# EAGLE design Captura_revB (EAGLE 5.11)
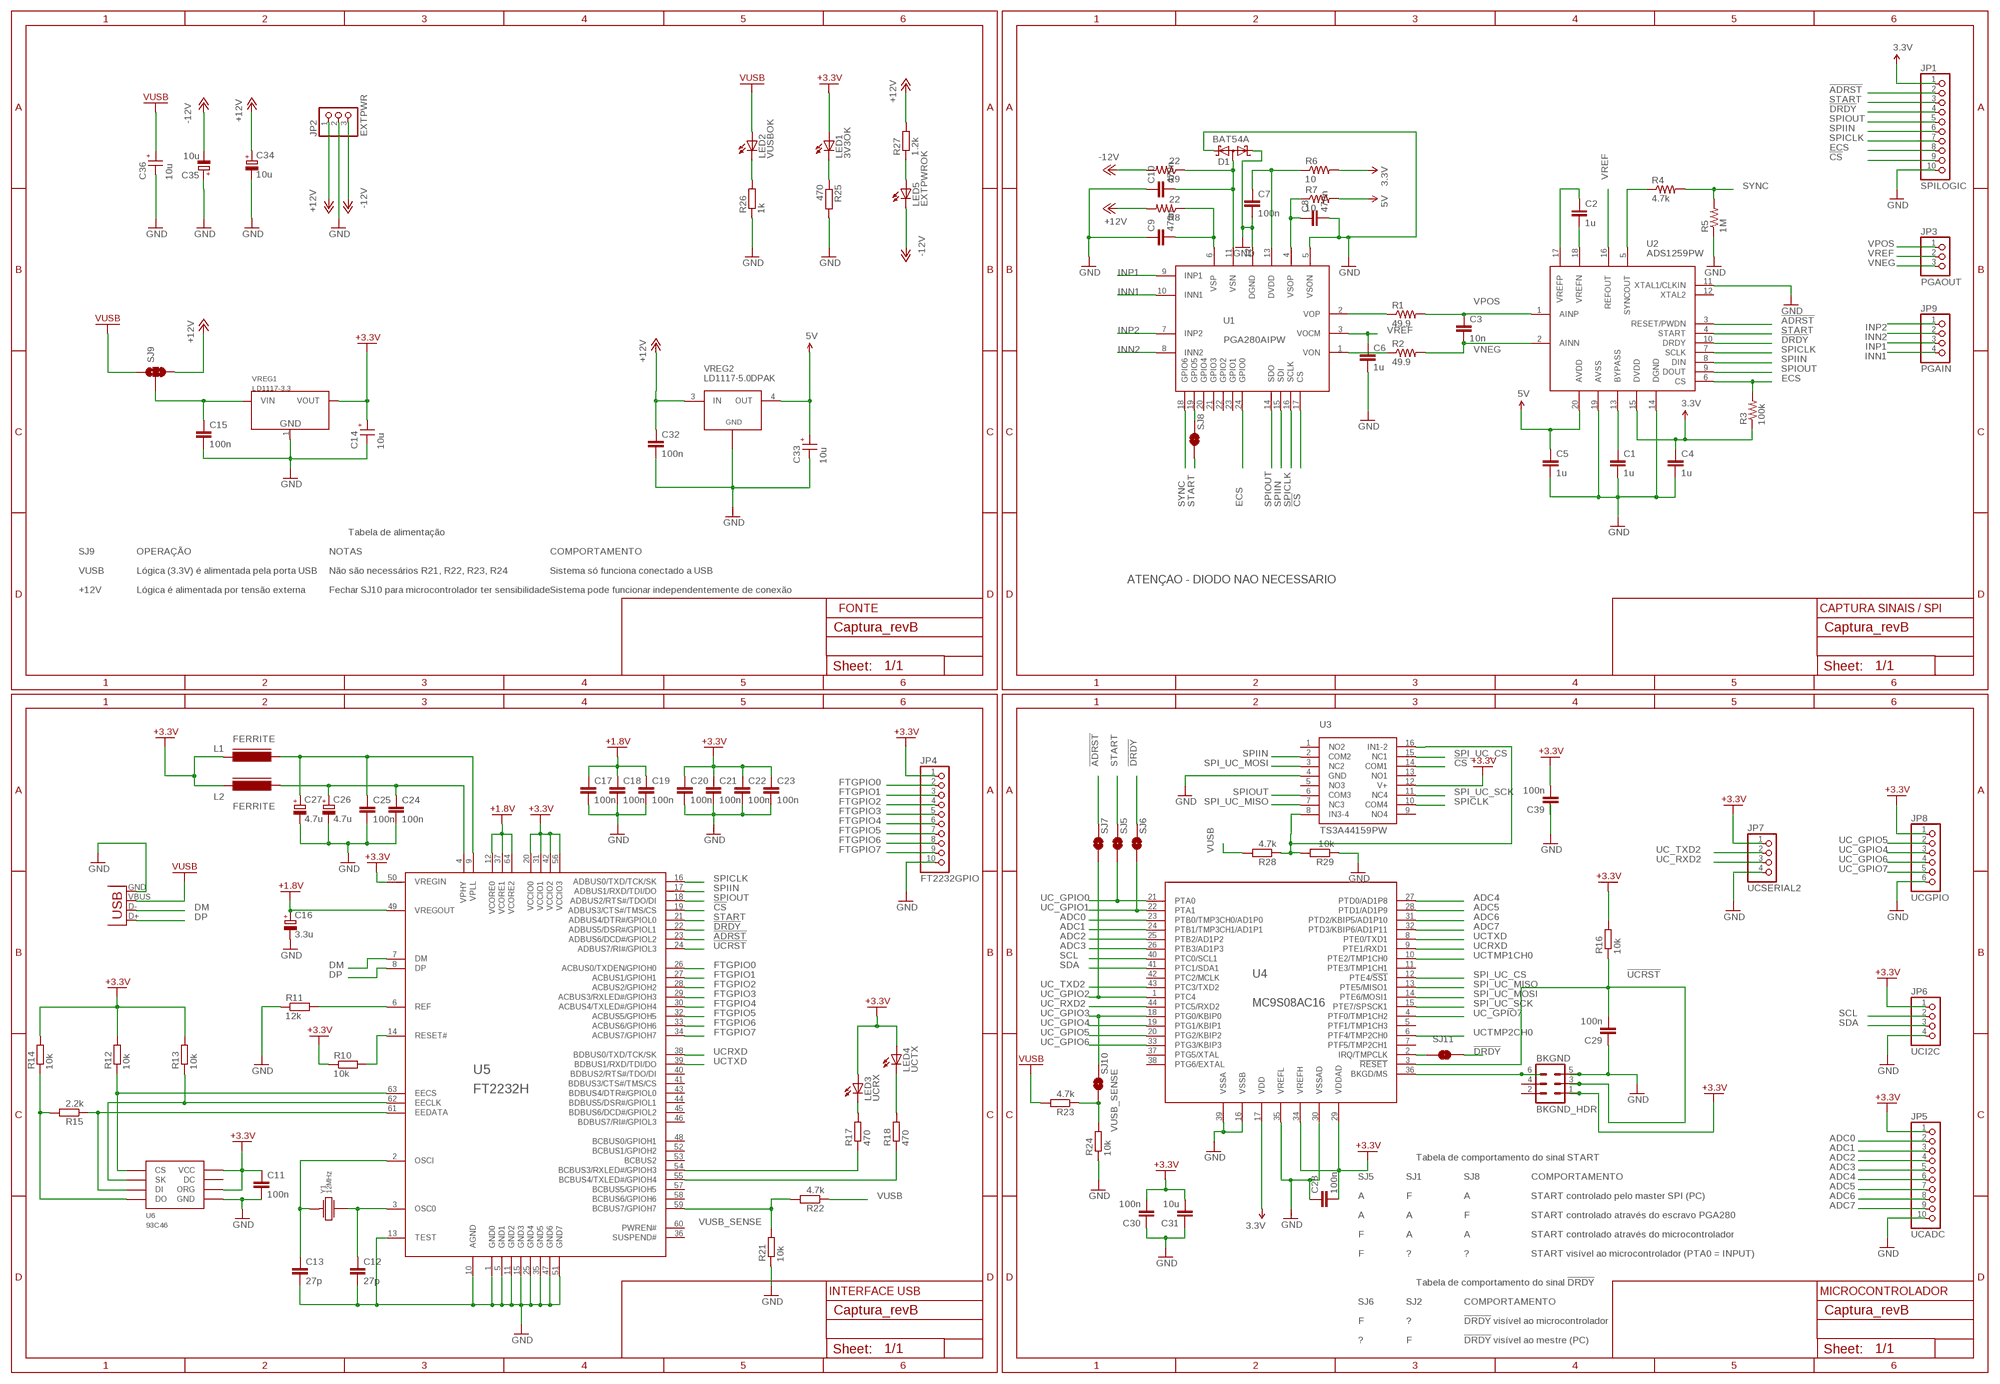
[diagram p0: schematic, sheet 1]

## Parts
BKGND  BKGND_HDR  [BKGNDHDR]
C1  1u  C-EUC0805  [C0805]
C2  1u  C-EUC0805  [C0805]
C3  10n  C-EUC0805  [C0805]
C4  1u  C-EUC0805  [C0805]
C5  1u  C-EUC0805  [C0805]
C6  1u  C-EUC0805  [C0805]
C7  100n  C-EUC0805K  [C0805K]
C8  470n  C-EUC0805  [C0805]
C9  470n  C-EUC0805  [C0805]
C10  470n  C-EUC0805  [C0805]
C11  100n  C-EUC0805K  [C0805K]
C12  27p  CAPC603  [C603]
C13  27p  CAPC603  [C603]
C14  10u  CPOLA  [CASE_A]
C15  100n  C-EUC0805K  [C0805K]
C16  3.3u  CAP_POLSMC_B  [SMC_B]
C17  100n  C-EUC0805K  [C0805K]
C18  100n  C-EUC0805K  [C0805K]
C19  100n  C-EUC0805K  [C0805K]
C20  100n  C-EUC0805K  [C0805K]
C21  100n  C-EUC0805K  [C0805K]
C22  100n  C-EUC0805K  [C0805K]
C23  100n  C-EUC0805K  [C0805K]
C24  100n  C-EUC0805K  [C0805K]
C25  100n  C-EUC0805K  [C0805K]
C26  4.7u  CAP_POLSMC_B  [SMC_B]
C27  4.7u  CAP_POLSMC_B  [SMC_B]
C28  100n  C-EUC0805K  [C0805K]
C29  100n  C-EUC0805K  [C0805K]
C30  100n  C-EUC0805K  [C0805K]
C31  10u  C-EUC0805K  [C0805K]
C32  100n  C-EUC0805K  [C0805K]
C33  10u  CPOLA  [CASE_A]
C34  10u  CAP_POLSMC_B  [SMC_B]
C35  10u  CAP_POLSMC_B  [SMC_B]
C36  10u  CPOLA  [CASE_A]
C39  100n  C-EUC0805K  [C0805K]
D1  BAT54A  [SOT23]
JP1  SPILOGIC  PINHD-1X10THIN  [1X10THIN]
JP2  EXTPWR  PINHD-1X3  [1X03]
JP3  PGAOUT  PINHD-1X3THIN  [1X03THIN]
JP4  FT2232GPIO  PINHD-1X10THIN  [1X10THIN]
JP5  UCADC  PINHD-1X10THIN  [1X10THIN]
JP6  UCI2C  PINHD-1X4THIN  [1X04THIN]
JP7  UCSERIAL2  PINHD-1X4THIN  [1X04THIN]
JP8  UCGPIO  PINHD-1X6THIN  [1X06THIN]
JP9  PGAIN  PINHD-1X4THIN  [1X04THIN]
L1  FERRITE  FERRITE_BEAD805  [FB805]
L2  FERRITE  FERRITE_BEAD805  [FB805]
LED1  3V3OK  LED805  [LED-805]
LED2  VUSBOK  LED805  [LED-805]
LED3  UCRX  LED805  [LED-805]
LED4  UCTX  LED805  [LED-805]
LED5  EXTPWROK  LED805  [LED-805]
R1  49.9  R-US_R0805  [R0805]
R2  49.9  R-US_R0805  [R0805]
R3  100k  R-US_R0805  [R0805]
R4  4.7k  R-US_R0805  [R0805]
R5  1M  R-US_R1206  [R1206]
R6  10  R-US_R0603  [R0603]
R7  10  R-US_R0603  [R0603]
R8  22  R-US_R0805  [R0805]
R9  22  R-US_R0805  [R0805]
R10  10k  RESISTORR805R805  [R805]
R11  12k  RESISTORR805R805  [R805]
R12  10k  RESISTORR805R805  [R805]
R13  10k  RESISTORR805R805  [R805]
R14  10k  RESISTORR805R805  [R805]
R15  2.2k  RESISTORR805R805  [R805]
R16  10k  RESISTORR805R805  [R805]
R17  470  RESISTORR805R805  [R805]
R18  470  RESISTORR805R805  [R805]
R21  10k  RESISTORR805R805  [R805]
R22  4.7k  RESISTORR805R805  [R805]
R23  4.7k  RESISTORR805R805  [R805]
R24  10k  RESISTORR805R805  [R805]
R25  470  RESISTORR805R805  [R805]
R26  1k  RESISTORR805R805  [R805]
R27  1.2k  RESISTORR805R805  [R805]
R28  4.7k  RESISTORR805R805  [R805]
R29  10k  RESISTORR805R805  [R805]
SJ5  START_UC  SOLDERJUMPERNO  [SJ_2S-NO]
SJ6  DRDY_UC  SOLDERJUMPERNO  [SJ_2S-NO]
SJ7  ADRST_UC  SOLDERJUMPERNO  [SJ_2S-NO]
SJ8  PGASTART  SOLDERJUMPERNO  [SJ_2S-NO]
SJ9  SOLDERJUMPER_2WAYT  [SJ_2]
SJ10  VUSB_SENSE_UC  SOLDERJUMPERNO  [SJ_2S-NO]
SJ11  DRDY_UC_INT  SOLDERJUMPERNO  [SJ_2S-NO]
U1  PGA280AIPW  [TSSOP24]
U2  ADS1259PW  [TSSOP20]
U3  TS3A44159PW  [TSSOP16]
U4  MC9S08AC16  MC9S08AC16CFGE2  [QFP44]
U5  FT2232H  [LQFP64]
U6  93C46  [SOIC8]
VREG1  LD1117-3.3  LD1117-3.3SOT223  [SOT223]
VREG2  LD1117-5.0DPAK  [DPAK]
X2  USBPTH  [USB-B-PTH]
Y1  12MHz  ABM7  [ABM7]

## Nets
5V: C5.1 C33.+ R7.2 U2.20(AVDD) VREG2.4(OUT)
!ADRST: JP1.2 SJ7.2 U2.3(RESET/PWDN) U5.23(ADBUS6/DCD#/GPIOL2)
!CS: JP1.9 U1.17(CS) U3.14(COM1) U5.19(ADBUS3/CTS#/TMS/CS)
!DRDY: JP1.4 SJ6.2 SJ11.1 U2.10(DRDY) U5.22(ADBUS5/DSR#/GPIOL1)
!UCRST: BKGND.3 C29.2 R16.1 U4.3(!RESET) U5.24(ADBUS7/RI#/GPIOL3)
+1.8V: C16.+ C17.1 C18.1 C19.1 U5.12(VCORE0) U5.37(VCORE1) U5.49(VREGOUT) U5.64(VCORE2)
+3.3V: BKGND.1 C4.1 C11.1 C14.+ C20.1 C21.1 C22.1 C23.1 C28.2 C30.2 C31.2 C39.2 JP1.1 JP4.1 JP5.1 JP6.1 JP7.1 JP8.1 L1.2 L2.2 LED1.A LED3.A LED4.A R3.1 R6.2 R10.1 R12.2 R13.2 R14.2 R16.2 U2.15(DVDD) U3.12(V+) U4.17(VDD) U4.29(VDDAD) U4.34(VREFH) U5.20(VCCIO0) U5.31(VCCIO1) U5.42(VCCIO2) U5.50(VREGIN) U5.56(VCCIO3) U6.6(ORG) U6.8(VCC) VREG1.2(VOUT) ; supply symbol labelled 3.3V
+12V: C32.1 C34.+ JP2.1 R8.2 R27.2 SJ9.3 VREG2.3(IN)
-12V: C35.- JP2.3 LED5.C R9.2
\RESET: R10.2 U5.14(RESET#)
ADC0: JP5.2 U4.23(PTB0/TMP3CH0/AD1P0)
ADC1: JP5.3 U4.24(PTB1/TMP3CH1/AD1P1)
ADC2: JP5.4 U4.25(PTB2/AD1P2)
ADC3: JP5.5 U4.26(PTB3/AD1P3)
ADC4: JP5.6 U4.27(PTD0/AD1P8)
ADC5: JP5.7 U4.28(PTD1/AD1P9)
ADC6: JP5.8 U4.31(PTD2/KBIP5/AD1P10)
ADC7: JP5.9 U4.32(PTD3/KBIP6/AD1P11)
DM: U5.7(DM) X2.D-
DP: U5.8(DP) X2.D+
ECS: JP1.8 R3.2 U1.24(GPIO0) U2.6(CS)
FTGPIO0: JP4.2 U5.26(ACBUS0/TXDEN/GPIOH0)
FTGPIO1: JP4.3 U5.27(ACBUS1/GPIOH1)
FTGPIO2: JP4.4 U5.28(ACBUS2/GPIOH2)
FTGPIO3: JP4.5 U5.29(ACBUS3/RXLED#/GPIOH3)
FTGPIO4: JP4.6 U5.30(ACBUS4/TXLED#/GPIOH4)
FTGPIO5: JP4.7 U5.32(ACBUS5/GPIOH5)
FTGPIO6: JP4.8 U5.33(ACBUS6/GPIOH6)
FTGPIO7: JP4.9 U5.34(ACBUS7/GPIOH7)
GND: BKGND.5 C1.2 C4.2 C5.2 C6.2 C7.2 C8.2 C9.1 C10.1 C11.2 C12.2 C13.2 C14.- C15.2 C16.- C17.2 C18.2 C19.2 C20.2 C21.2 C22.2 C23.2 C24.2 C25.2 C26.- C27.- C28.1 C29.1 C30.1 C31.1 C32.2 C33.- C34.- C35.+ C36.- C39.1 D1.1(K1) D1.2(K2) JP1.10 JP2.2 JP4.10 JP5.10 JP6.4 JP7.4 JP8.6 R5.1 R11.1 R21.1 R24.1 R25.2 R26.1 R29.1 U1.5(VSON) U1.12(DGND) U2.11(XTAL1/CLKIN) U2.14(DGND) U2.19(AVSS) U3.4(GND) U4.16(VSSB) U4.30(VSSAD) U4.35(VREFL) U4.39(VSSA) U5.1(GND0) U5.5(GND1) U5.10(AGND) U5.11(GND2) U5.13(TEST) U5.15(GND3) U5.25(GND4) U5.35(GND5) U5.47(GND6) U5.51(GND7) U6.5(GND) VREG1.1(GND) VREG2.1(GND) X2.GND
INN1: JP9.4 U1.10(INN1)
INN2: JP9.2 U1.8(INN2)
INP1: JP9.3 U1.9(INP1)
INP2: JP9.1 U1.7(INP2)
N$1: C1.1 U2.13(BYPASS)
N$2: C2.2 U2.18(VREFN)
N$3: C2.1 U2.17(VREFP)
N$4: SJ11.2 U4.2(IRQ/TMPCLK)
N$6: R1.1 U1.2(VOP)
N$7: R2.1 U1.1(VON)
N$8: R4.1 U2.5(SYNCOUT)
N$10: C7.1 R6.1 U1.13(DVDD)
N$11: C9.2 R8.1 U1.6(VSP)
N$12: C8.1 R7.1 U1.4(VSOP)
N$13: C10.2 D1.3(AA) R9.1 U1.11(VSN)
N$14: BKGND.6 U4.36(BKGD/MS)
N$15: C12.1 U5.3(OSC0) Y1.2
N$16: R12.1 U5.63(EECS) U6.1(CS)
N$17: R13.1 U5.62(EECLK) U6.2(SK)
N$18: R15.1 U5.61(EEDATA) U6.3(DI)
N$19: C13.1 U5.2(OSCI) Y1.1
N$20: R17.1 U5.54(BCBUS3/RXLED#/GPIOH3)
N$21: R18.1 U5.55(BCBUS4/TXLED#/GPIOH4)
N$22: R11.2 U5.6(REF)
N$23: LED3.C R17.2
N$24: R14.1 R15.2 U6.4(DO)
N$25: LED4.C R18.2
N$30: C24.1 C26.+ L2.1 U5.4(VPHY)
N$31: C25.1 C27.+ L1.1 U5.9(VPLL)
N$32: SJ8.2 U1.19(GPIO5)
N$34: C15.1 SJ9.2 VREG1.3(VIN)
N$35: R23.1 R24.2 SJ10.1
N$36: LED1.C R25.1
N$37: LED2.C R26.2
N$38: R21.2 R22.2 U5.59(BCBUS7/GPIOH7)
N$39: LED5.A R27.1
N$54: R28.1 R29.2 U3.8(IN3-4) U3.16(IN1-2)
SCL: JP6.2 U4.40(PTC0/SCL1)
SDA: JP6.3 U4.41(PTC1/SDA1)
SPI_UC_CS: U3.15(NC1) U4.12(PTE4/!SS1)
SPI_UC_MISO: U3.7(NC3) U4.13(PTE5/MISO1)
SPI_UC_MOSI: U3.3(NC2) U4.14(PTE6/MOSI1)
SPI_UC_SCK: U3.11(NC4) U4.15(PTE7/SPSCK1)
SPICLK: JP1.7 U1.16(SCLK) U2.7(SCLK) U3.10(COM4) U5.16(ADBUS0/TXD/TCK/SK)
SPIIN: JP1.6 U1.15(SDI) U2.8(DIN) U3.2(COM2) U5.17(ADBUS1/RXD/TDI/DO)
SPIOUT: JP1.5 U1.14(SDO) U2.9(DOUT) U3.6(COM3) U5.18(ADBUS2/RTS#/TDO/DI)
START: JP1.3 SJ5.2 SJ8.1 U2.4(START) U5.21(ADBUS4/DTR#/GPIOL0)
SYNC: R4.2 R5.2 U1.18(GPIO6)
UC_GPIO0: SJ5.1 U4.21(PTA0)
UC_GPIO1: SJ6.1 U4.22(PTA1)
UC_GPIO2: SJ7.1 U4.1(PTC4)
UC_GPIO3: SJ10.2 U4.18(PTG0/KBIP0)
UC_GPIO4: JP8.3 U4.19(PTG1/KBIP1)
UC_GPIO5: JP8.2 U4.20(PTG2/KBIP2)
UC_GPIO6: JP8.4 U4.33(PTG3/KBIP3)
UC_GPIO7: JP8.5 U4.4(PTF0/TMP1CH2)
UC_RXD2: JP7.3 U4.44(PTC5/RXD2)
UC_TXD2: JP7.2 U4.43(PTC3/TXD2)
UCRXD: U4.9(PTE1/RXD1) U5.38(BDBUS0/TXD/TCK/SK)
UCTMP1CH0: U4.10(PTE2/TMP1CH0)
UCTMP2CH0: U4.6(PTF4/TMP2CH0)
UCTXD: U4.8(PTE0/TXD1) U5.39(BDBUS1/RXD/TDI/DO)
VNEG: C3.2 JP3.3 R2.2 U2.2(AINN)
VPOS: C3.1 JP3.1 R1.2 U2.1(AINP)
VREF: C6.1 JP3.2 U1.3(VOCM) U2.16(REFOUT)
VUSB: C36.+ LED2.A R22.1 R23.2 R28.2 SJ9.1 X2.VBUS
Unconnected: BKGND.2 BKGND.4 U1.20(GPIO4) U1.21(GPIO3) U1.22(GPIO2) U1.23(GPIO1) U2.12(XTAL2) U3.1(NO2) U3.5(NO3) U3.9(NO4) U3.13(NO1) U4.5(PTF1/TMP1CH3) U4.7(PTF5/TMP2CH1) U4.11(PTE3/TMP1CH1) U4.37(PTG5/XTAL) U4.38(PTG6/EXTAL) U4.42(PTC2/MCLK) U5.36(SUSPEND#) U5.40(BDBUS2/RTS#/TDO/DI) U5.41(BDBUS3/CTS#/TMS/CS) U5.43(BDBUS4/DTR#/GPIOL0) U5.44(BDBUS5/DSR#/GPIOL1) U5.45(BDBUS6/DCD#/GPIOL2) U5.46(BDBUS7/RI#/GPIOL3) U5.48(BCBUS0/GPIOH1) U5.52(BCBUS1/GPIOH2) U5.53(BCBUS2) U5.57(BCBUS5/GPIOH5) U5.58(BCBUS6/GPIOH6) U5.60(PWREN#) U6.7(DC)

## Notes on the sheet
- Tabela de alimentação
- SJ9 | OPERAÇÃO | NOTAS | COMPORTAMENTO
- VUSB | Lógica (3.3V) é alimentada pela porta USB | Não são necessários R21, R22, R23, R24 | Sistema só funciona conectado a USB
- ATENÇAO - DIODO NAO NECESSARIO
- +12V | Lógica é alimentada por tensão externa | Fechar SJ10 para microcontrolador ter sensibilidade | Sistema pode funcionar independentemente de conexão
- FONTE | CAPTURA SINAIS / SPI
- VUSB_SENSE
- Tabela de comportamento do sinal START
- SJ5 | SJ1 | SJ8 | COMPORTAMENTO
- A | F | A | START controlado pelo master SPI (PC)
- VUSB_SENSE | A | A | F | START controlado através do escravo PGA280
- F | A | A | START controlado através do microcontrolador
- F | ? | ? | START visível ao microcontrolador (PTA0 = INPUT)
- Tabela de comportamento do sinal !DRDY
- INTERFACE USB | MICROCONTROLADOR
- SJ6 | SJ2 | COMPORTAMENTO
- F | ? | !DRDY! visível ao microcontrolador
- ? | F | !DRDY! visível ao mestre (PC)

## Library data of the parts
BKGND = biblioteca:BKGND_HDR
C1-C11 C15 C17-C25 C28-C32 C39 = rcl:C-EU: CAPACITOR, European symbol
C12 C13 = dp_devices:CAP
C14 C33 C36 = Capacitores:CPOL: Capacitor de tântalo SMD, case A
C16 C26 C27 C34 C35 = dp_devices:CAP_POL
D1 = diode:BAT54A: Schottky Diodes Source: Fairchild .. BAT54.pdf
JP1 JP4 JP5 = pinhead_x:PINHD-1X10: PIN HEADER
JP2 JP3 = pinhead_x:PINHD-1X3: PIN HEADER
JP6 JP7 JP9 = pinhead_x:PINHD-1X4: PIN HEADER
JP8 = pinhead_x:PINHD-1X6: PIN HEADER
L1 L2 = dp_devices:FERRITE_BEAD
LED1-LED5 = dp_devices:LED
R1-R9 = rcl:R-US_: RESISTOR, American symbol
R10-R18 R21-R29 = dp_devices:RESISTOR
SJ5-SJ8 SJ10 SJ11 = SparkFun:SOLDERJUMPER: Solder Jumper Standard SMD solder jumper. Used to automate production. Two varients : Normally Open and Normally Closed are the same, but have different paste layers. NC will have a large amount of paste and should jumper during reflow.
SJ9 = SparkFun:SOLDERJUMPER_2WAY: Solder Jumper 2 way solder jumper
U1 = CircuitosIntegrados:PGA280: Zerø-Drift, High-Voltage, Programmable Gain INSTRUMENTATION AMPLIFIER
U2 = CircuitosIntegrados:ADS1259: Industrial, 14kSPS, 24-Bit Analog-to-Digital Converter with Low-Drift Reference
U3 = CircuitosIntegrados:TS3A44159
U4 = biblioteca:MC9S08AC16
U5 = dp_devices:FT2232H: DUAL HIGH SPEED USB TO MULTIPURPOSE UART/FIFO IC
U6 = dp_devices:93C46; 93C46: 93C46
VREG1 = dp_devices:LD1117-3.3
VREG2 = CircuitosIntegrados:LD1117-5.0: Low dropout voltage regulator, 5.0V fixed, 800mA
X2 = SparkFun:USB: USB Connectors USB-B-PTH is fully proven SKU : PRT-00139 USB-miniB is fully proven SKU : PRT-00587 USB-A-PCB is untested. USB-A-H is throughly reviewed, but untested. Spark Fun Electronics SKU : PRT-00437 USB-B-SMT is throughly reviewed, but untested. Needs silkscreen touching up. USB-A-S has not been used/tested USB-MB-H has not been used/tested
Y1 = Cristais:ABM7: Cristal SMD Abracon ABM7 http://search.digikey.com/scripts/DkSearch/dksus.dll?Detail&name=535-9836-1-ND

## Board
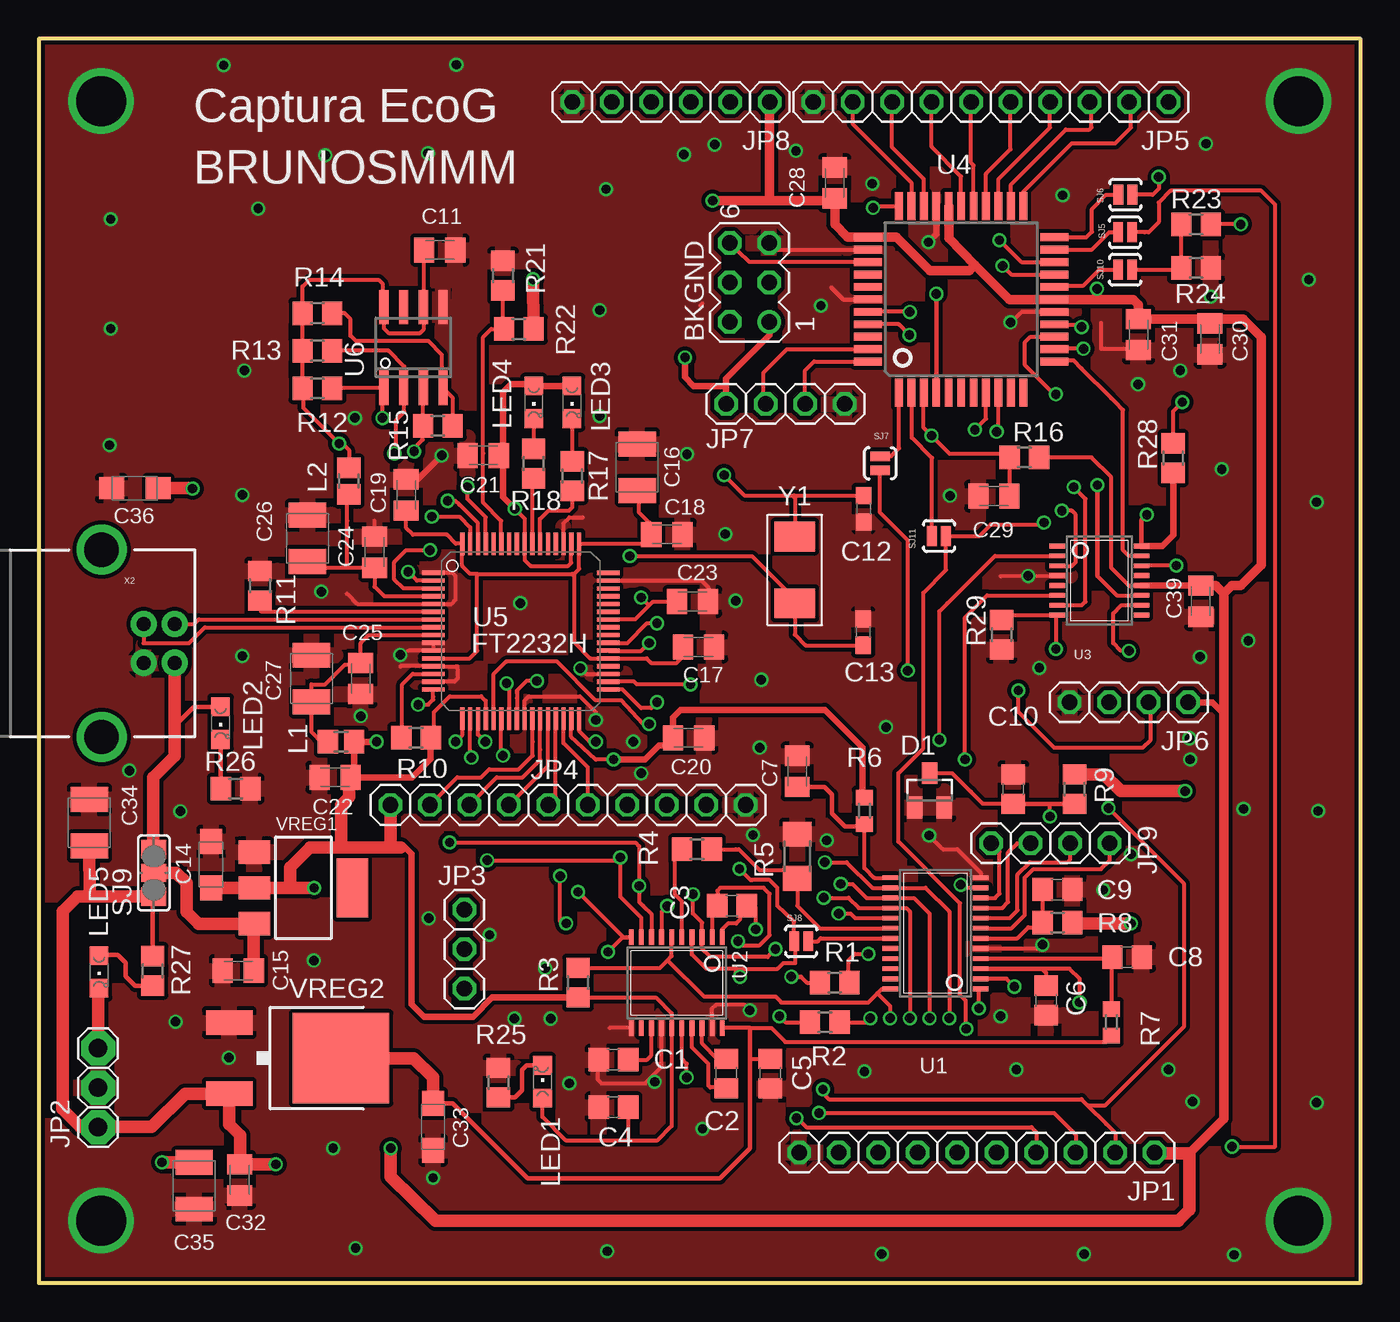
[diagram p1: board, top side]
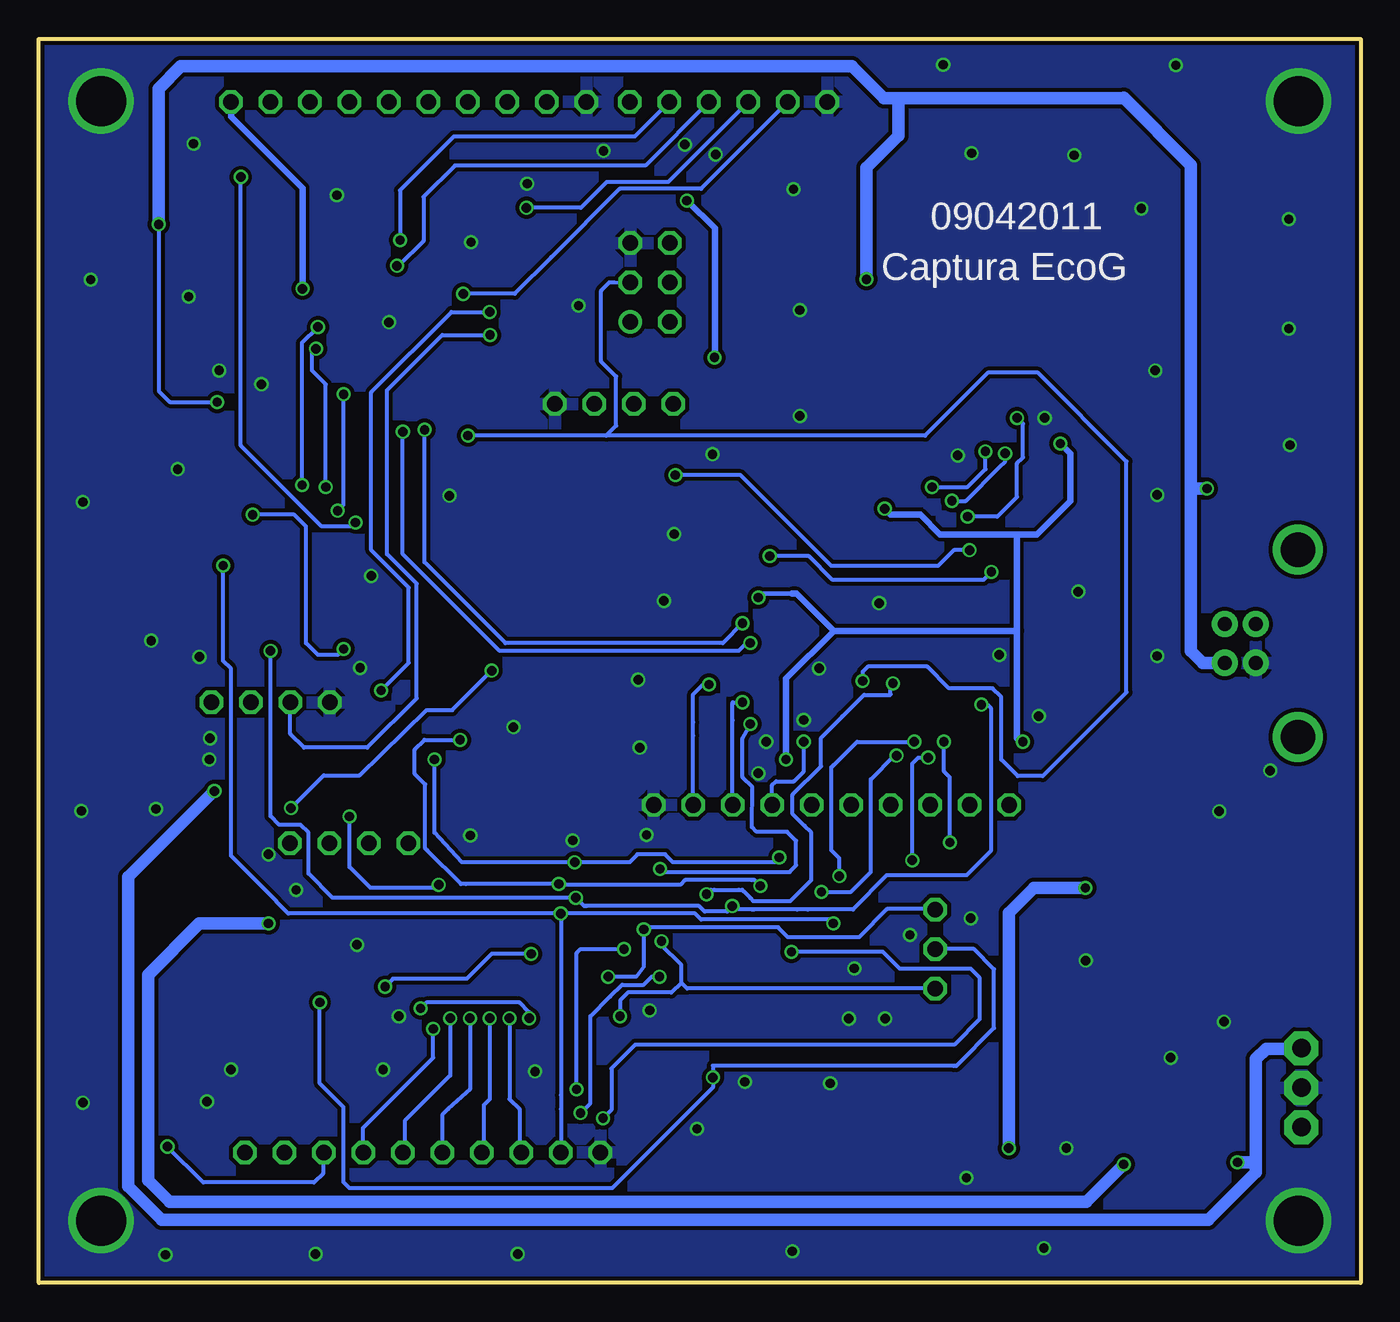
[diagram p2: board, bottom side, seen from below]

Size 85 x 80 mm. Coordinates in mm from the lower left corner, seen from the top.
Outline: 0,0 85,0 85,80 0,80 0,0
Copper layers (1*16): Top 0.035mm / dielectric 1.5mm / Bottom 0.035mm
Design rules "Fusion_eagle_rule_v1.1": minimum track width 6mil, minimum drill 12mil, track to track 6mil, track to pad 6mil, pad to pad 6mil, via to via 6mil, smd to smd 0mil, copper to edge 10mil, drill to drill 10mil, minimum pad ring 10mil, minimum via ring 6mil, stop-mask expansion 2mil, vias tented up to drill 100mil, thermal gap 10mil

### Footprints (pad centres in the part's own frame; a part is rotated, then mirrored left to right if it is on the bottom)
BKGNDHDR = drill 1 round: 1 -2.54,-1.27 | drill 1 octagon: 2 -2.54,1.27; 3 0,-1.27; 4 0,1.27; 5 2.54,-1.27; 6 2.54,1.27
C0805 = smd 1.3 x 1.5: 1 -0.95,0; 2 0.95,0
C0805K = smd 1.3 x 1.6: 1 -1,0; 2 1,0
C603 = smd 1.1 x 1: 1 -0.85,0; 2 0.85,0
CASE_A = smd 1.6 x 1.4: + -1.5,0; - 1.5,0
SMC_B = smd 1.6 x 2.4: + -1.5,0; - 1.5,0
SOT23 = smd 1 x 1.4: 1 -0.95,-1.1; 2 0.95,-1.1; 3 0,1.1
1X10THIN = drill 1 octagon: 1 -11.43,0; 2 -8.89,0; 3 -6.35,0; 4 -3.81,0; 5 -1.27,0; 6 1.27,0; 7 3.81,0; 8 6.35,0; 9 8.89,0; 10 11.43,0
1X03 = drill 1.2 pad 2.184 octagon: 1 -2.54,0; 2 0,0; 3 2.54,0
1X03THIN = drill 1 octagon: 1 -2.54,0; 2 0,0; 3 2.54,0
1X04THIN = drill 1 octagon: 1 -3.81,0; 2 -1.27,0; 3 1.27,0; 4 3.81,0
1X06THIN = drill 1 octagon: 1 -6.35,0; 2 -3.81,0; 3 -1.27,0; 4 1.27,0; 5 3.81,0; 6 6.35,0
FB805 = smd 1.3 x 1.5: 1 -0.85,0; 2 0.85,0
LED-805 = smd 1.2 x 1.2: A 0,-1.05; C 0,1.05
R0805 = smd 1.3 x 1.5: 1 -0.95,0; 2 0.95,0
R1206 = smd 1.6 x 1.803: 1 -1.422,0; 2 1.422,0
R0603 = smd 1 x 1.1: 1 -0.85,0; 2 0.85,0
R805 = smd 1.3 x 1.5: 1 -0.95,0; 2 0.95,0
SJ_2S-NO = smd 0.635 x 1.27: 1 -0.45,0; 2 0.45,0
SJ_2 = smd 1.168 x 1.6: 1 -1.524,0; 2 0,0; 3 1.524,0
TSSOP24 = smd 0.305 x 0.991: 1 -3.575,-2.918; 2 -2.925,-2.918; 3 -2.275,-2.918; 4 -1.625,-2.918; 5 -0.975,-2.918; 6 -0.325,-2.918; 7 0.325,-2.918; 8 0.975,-2.918; 9 1.625,-2.918; 10 2.275,-2.918; 11 2.925,-2.918; 12 3.575,-2.918; 13 3.575,2.918; 14 2.925,2.918; 15 2.275,2.918; 16 1.625,2.918; 17 0.975,2.918; 18 0.325,2.918; 19 -0.325,2.918; 20 -0.975,2.918; 21 -1.625,2.918; 22 -2.275,2.918; 23 -2.925,2.918; 24 -3.575,2.918
TSSOP20 = smd 0.305 x 0.991: 1 -2.925,-2.918; 2 -2.275,-2.918; 3 -1.625,-2.918; 4 -0.975,-2.918; 5 -0.325,-2.918; 6 0.325,-2.918; 7 0.975,-2.918; 8 1.625,-2.918; 9 2.275,-2.918; 10 2.925,-2.918; 11 2.925,2.918; 12 2.275,2.918; 13 1.625,2.918; 14 0.975,2.918; 15 0.325,2.918; 16 -0.325,2.918; 17 -0.975,2.918; 18 -1.625,2.918; 19 -2.275,2.918; 20 -2.925,2.918
TSSOP16 = smd 0.305 x 0.991: 1 -2.286,-2.845; 2 -1.651,-2.845; 3 -1.016,-2.845; 4 -0.381,-2.845; 5 0.254,-2.845; 6 0.889,-2.845; 7 1.524,-2.845; 8 2.159,-2.845; 9 2.159,2.591; 10 1.524,2.591; 11 0.889,2.591; 12 0.254,2.591; 13 -0.381,2.591; 14 -1.016,2.591; 15 -1.651,2.591; 16 -2.286,2.591
QFP44 = smd 0.5 x 1.8: 1 -4,-6; 2 -3.2,-6; 3 -2.4,-6; 4 -1.6,-6; 5 -0.8,-6; 6 0,-6; 7 0.8,-6; 8 1.6,-6; 9 2.4,-6; 10 3.2,-6; 11 4,-6; 23 4,6; 24 3.2,6; 25 2.4,6; 26 1.6,6; 27 0.8,6; 28 0,6; 29 -0.8,6; 30 -1.6,6; 31 -2.4,6; 32 -3.2,6; 33 -4,6 | smd 1.8 x 0.5: 12 6,-4; 13 6,-3.2; 14 6,-2.4; 15 6,-1.6; 16 6,-0.8; 17 6,0; 18 6,0.8; 19 6,1.6; 20 6,2.4; 21 6,3.2; 22 6,4; 34 -6,4; 35 -6,3.2; 36 -6,2.4; 37 -6,1.6; 38 -6,0.8; 39 -6,0; 40 -6,-0.8; 41 -6,-1.6; 42 -6,-2.4; 43 -6,-3.2; 44 -6,-4
LQFP64 = smd 1.45 x 0.27: 1 -5.625,3.75; 2 -5.625,3.25; 3 -5.625,2.75; 4 -5.625,2.25; 5 -5.625,1.75; 6 -5.625,1.25; 7 -5.625,0.75; 8 -5.625,0.25; 9 -5.625,-0.25; 10 -5.625,-0.75; 11 -5.625,-1.25; 12 -5.625,-1.75; 13 -5.625,-2.25; 14 -5.625,-2.75; 15 -5.625,-3.25; 16 -5.625,-3.75; 33 5.625,-3.75; 34 5.625,-3.25; 35 5.625,-2.75; 36 5.625,-2.25; 37 5.625,-1.75; 38 5.625,-1.25; 39 5.625,-0.75; 40 5.625,-0.25; 41 5.625,0.25; 42 5.625,0.75; 43 5.625,1.25; 44 5.625,1.75; 45 5.625,2.25; 46 5.625,2.75; 47 5.625,3.25; 48 5.625,3.75 | smd 0.27 x 1.45: 17 -3.75,-5.625; 18 -3.25,-5.625; 19 -2.75,-5.625; 20 -2.25,-5.625; 21 -1.75,-5.625; 22 -1.25,-5.625; 23 -0.75,-5.625; 24 -0.25,-5.625; 25 0.25,-5.625; 26 0.75,-5.625; 27 1.25,-5.625; 28 1.75,-5.625; 29 2.25,-5.625; 30 2.75,-5.625; 31 3.25,-5.625; 32 3.75,-5.625; 49 3.75,5.625; 50 3.25,5.625; 51 2.75,5.625; 52 2.25,5.625; 53 1.75,5.625; 54 1.25,5.625; 55 0.75,5.625; 56 0.25,5.625; 57 -0.25,5.625; 58 -0.75,5.625; 59 -1.25,5.625; 60 -1.75,5.625; 61 -2.25,5.625; 62 -2.75,5.625; 63 -3.25,5.625; 64 -3.75,5.625
SOIC8 = smd 0.6 x 2.2: 1 -1.905,-2.6; 2 -0.635,-2.6; 3 0.635,-2.6; 4 1.905,-2.6; 5 1.905,2.6; 6 0.635,2.6; 7 -0.635,2.6; 8 -1.905,2.6
SOT223 = smd 1.5 x 2: 1 -2.3,-3.15; 2 0,-3.15; 3 2.3,-3.15 | smd 3.8 x 2: 4 0,3.15
DPAK = smd 1.6 x 3: 1 -2.28,-4.8; 3 2.28,-4.8 | smd 5.8 x 6.2: 4 0,2.38
USB-B-PTH = drill 0.9 pad 1.676 round: D+ 0,1.25; D- 1.981,1.25; GND 0,-1.25; VBUS 1.981,-1.25 | drill 2.2 round: S1 -2.718,-6.02; S2 -2.718,6.02
ABM7 = smd 1.905 x 2.591: 1 -2.146,0; 2 2.146,0

### Placement (x,y rotation side)
BKGND  45.69,64.34 90 top
C1  36.96,14.35 180 top
C2  44.2,13.46 90 top
C3  44.58,24.26 180 top
C4  36.96,11.3 180 top
C5  47.04,13.46 270 top
C6  64.77,18.16 270 top
C7  48.77,32.89 90 top
C8  69.98,20.95 0 top
C9  65.51,25.3 180 top
C10  62.66,31.75 270 top
C11  25.78,66.42 0 top
C12  53.03,49.79 270 top
C13  53.01,41.85 90 top
C14  11.07,26.9 90 top
C15  12.83,20.08 180 top
C16  38.48,52.45 90 top
C17  42.42,40.89 0 top
C18  40.39,48.13 0 top
C19  23.62,50.67 90 top
C20  41.78,35.05 0 top
C21  28.57,53.21 180 top
C22  19.05,32.51 180 top
C23  42.04,43.81 0 top
C24  21.59,46.99 90 top
C25  20.7,38.86 270 top
C26  17.27,47.88 90 top
C27  17.53,38.86 90 top
C28  51.18,70.74 270 top
C29  61.42,50.6 0 top
C30  75.31,60.71 90 top
C31  70.71,60.99 90 top
C32  12.91,6.62 270 top
C33  25.35,10.03 270 top
C34  3.25,29.59 90 top
C35  9.98,6.25 90 top
C36  6.17,51.1 180 top
C39  74.71,43.84 90 top
D1  57.28,31.67 0 top
JP1  60.33,8.38 180 top
JP2  3.81,12.55 90 top
JP3  27.36,21.46 270 top
JP4  34.04,30.73 0 top
JP5  61.21,75.95 180 top
JP6  70.1,37.34 180 top
JP7  48.01,56.52 0 top
JP8  40.64,75.95 180 top
JP9  65.05,28.27 180 top
L1  19.43,34.8 0 top
L2  19.94,51.56 90 top
LED1  32.39,12.94 0 top
LED2  11.68,36 180 top
LED3  34.28,56.63 180 top
LED4  31.83,56.63 180 top
LED5  3.87,20 180 top
R1  51.18,19.3 180 top
R2  50.55,16.76 180 top
R3  34.67,19.3 90 top
R4  42.32,27.89 0 top
R5  48.77,27.43 270 top
R6  53.09,30.35 90 top
R7  68.96,16.76 270 top
R8  65.51,23.16 0 top
R9  66.6,31.75 90 top
R10  24.26,35.05 180 top
R11  14.22,44.83 270 top
R12  17.91,57.53 180 top
R13  17.91,59.94 180 top
R14  17.91,62.36 180 top
R15  25.65,55.12 0 top
R16  63.37,53.09 0 top
R17  34.31,51.88 90 top
R18  31.81,52.69 90 top
R21  29.84,64.77 270 top
R22  30.86,61.34 180 top
R23  74.42,68.07 0 top
R24  74.42,65.28 180 top
R25  29.56,12.88 90 top
R26  12.65,31.78 180 top
R27  7.32,20.07 90 top
R28  72.94,53.04 90 top
R29  61.91,41.68 90 top
SJ5  69.85,67.56 0 top
SJ6  69.88,69.98 0 top
SJ7  54.1,52.7 270 top
SJ8  49.02,21.97 0 top
SJ9  7.39,26.36 270 top
SJ10  69.85,65.15 180 top
SJ11  57.89,48.03 180 top
U1  57.66,22.48 90 top
U2  41.02,19.3 180 top
U3  68.32,45.1 270 top
U4  59.31,63.25 0 top
U5  30.99,41.91 0 top
U6  24.09,60.15 0 top
VREG1  17.01,25.4 270 top
VREG2  17.04,14.45 270 top
X2  6.75,41.13 0 top
Y1  48.62,45.85 90 top

### Tracks (layer width: path | path; a pad name or v marks a point on that pad's centre or on a via)
5V
  Top 0.254: U2.20 45.72,16.39 47.11,16.39 48.01,15.49 68.64,15.49 R7.2 | 45.72,13.61 45.73,13.6 | C5.1 45.73,14.41 45.72,14.4
  Top 0.305: 45.72,16.39 45.72,14.4 45.72,13.61 45.72,8.64 43.81,6.73 33.07,6.73 31.42,6.73 26.62,11.53 C33.+
  Top 0.813: VREG2.4 24.11,14.45 25.35,13.21 C33.+
!ADRST  (via drill 0.6)
  Top 0.254: v47.37,21.46 46.86,20.95 43.18,20.95 42.65,21.49 U2.3 42.65,23.16 42.06,23.75 v42.06,24.99 | v50.42,12.45 50.42,12.19 50.8,11.81 67.06,11.81 67.44,11.43 | 67.44,11.43 68.64,10.22 69.22,9.65 69.22,8.78 JP1.2 | v55.88,39.37 55.88,47.75 54.1,49.53 54.1,52.07 SJ7.2 | 67.44,11.43 68.58,11.43 73.66,16.51 73.66,22.86 73.66,25.65 v68.78,30.53 | U5.23 30.24,38.39 v30.07,38.56
  Bottom 0.254: v47.37,21.46 50.16,21.46 50.42,21.21 v50.42,12.45 | v55.88,39.37 58.42,36.83 60.07,36.83 64.39,32.64 66.67,32.64 v68.78,30.53 | v42.06,24.99 41.78,25.27 41.55,25.27 39.98,25.27 39.78,25.27 39.7,25.2 39.24,24.74 39.06,24.56 36.68,24.56 35.33,25.91 35.33,28.96 35.76,29.39 36.52,30.15 36.52,31.39 34.7,33.22 34.7,35.05 33.33,36.42 31.93,37.82 30.25,37.82 30.23,37.85 30.23,38.41 v30.07,38.56
!CS  (via drill 0.6, 0.6 pad 0.81)
  Top 0.254: U1.17 53.63,23.45 52.49,23.45 52.2,23.75 v51.44,23.75 | U5.19 28.24,35.26 v28.7,34.8 | v33.91,23.11 33.66,23.11 33.53,23.24 v33.53,26.16 | U3.14 73.14,46.12 v73.15,46.13
  Bottom 0.254: v51.44,23.75 51.44,12.06 51.44,11.18 51.44,8.9 JP1.9 | v73.15,46.13 73.15,42.16 73.15,40.01 72.64,39.5 72.64,38.1 72.64,27.46 69.72,24.54 69.72,24.51 69.34,24.13 69.22,24 69.09,23.88 68.96,23.75 v51.44,23.75 | v28.7,34.8 32.38,34.8 33.78,33.4 33.91,33.27 34.04,33.15 34.04,27.81 33.53,27.3 v33.53,26.16 | v51.44,23.75 42.8,23.75 42.42,23.37 34.16,23.37 | 34.16,23.37 v33.91,23.11 34.16,23.37
!DRDY  (via drill 0.6)
  Top 0.254: 29.72,36.27 U5.22 29.74,34.02 v29.84,33.91 | v34.67,25.15 35.35,24.47 36.58,23.24 37.59,22.22 U2.10 37.54,22.22 v36.6,21.29 | v72.01,71.12 72.01,70.36 71.75,70.1 71.63,69.98 SJ6.2 | v64.64,48.9 64.52,48.77 61.21,48.77 60.47,48.03 SJ11.1 58.34,45.84 56.87,44.37 56.87,34.37 55.27,32.77 55.27,28.37 59.23,24.41 59.23,18.52 59.61,18.14 59.61,16.36 v59.64,16.33 | v48.72,10.59 48.77,10.59 49.35,10.01 63.83,10.01 64.16,9.68 64.16,8.41 JP1.4
  Bottom 0.254: v29.84,33.91 29.97,33.91 31.5,32.38 31.5,28.32 31.5,26.42 32.77,25.15 v34.67,25.15 | v72.01,71.12 72.01,53.85 66.8,48.64 64.9,48.64 v64.64,48.9 | v59.64,16.33 59.64,14.48 64.16,9.96 64.16,8.41 JP1.4 | v36.6,21.29 30.73,21.29 29.64,20.19 25.07,20.19 24.49,19.61 24.49,16.97 26.14,15.32 46.48,15.32 46.66,15.32 48.18,13.79 48.18,11.12 v48.72,10.59
!UCRST  (via drill 0.6, 0.6 pad 0.81)
  Top 0.254: U4.3 56.9,57.23 56.9,54.99 v57.4,54.48 57.59,54.29 58.56,53.32 58.67,53.32 60.22,53.32 62.19,53.32 R16.1 C29.2 | U5.24 30.74,37.6 30.74,37.95 30.74,38.08 31.37,38.71 v32.03,38.71
  Top 0.305: v57.4,54.48 57.59,54.29
  Bottom 0.254: 48.51,54.48 v57.4,54.48 | 48.51,54.48 47.88,55.12 47.88,58.29 48.84,59.26 48.84,63.8 48.31,64.34 48.01,64.34 BKGND.3 | 48.51,54.48 28.02,54.48 23.98,58.52 20.75,58.52 15.06,52.83 15.06,37.97 20.45,32.59 22.05,32.59 23.11,33.66 23.11,37.67 23.67,38.23 26.47,38.23 27.86,39.62 31.7,39.62 32.03,39.29 v32.03,38.71
+1.8V
  Top 0.254: C16.+ 38.61,50.82 38.61,49.53 38.73,49.4 38.99,49.15 39.39,48.75 C18.1 39.35,47.53 U5.49 34.74,45.91 34.42,45.59 34.29,45.59 | C19.1 23.62,49.4 C19.1 | 28.19,45.59 34.29,45.59 | U5.12 27.71,40.16 28.19,40.64 28.19,45.59 | C17.1 41.4,40.88 41.4,40.26 41.02,39.88 39.37,39.88 39.09,40.16 U5.37 35.46,40.16 34.42,41.2 34.42,45.47 34.29,45.59 | 28.19,45.59 27.74,45.59 27.23,46.1 27.23,47.53 U5.64 26.81,47.53 26.24,48.11 24.05,48.11 23.62,48.54 C19.1
+3.3V  (via drill 0.6, 0.6 pad 0.81)
  Top 0.254: C11.1 24.78,62.81 U6.6 24.77,62.71 24.77,61.34 24.51,61.09 22.48,61.09 22.18,61.38 U6.8 22.1,62.84 22.1,64.26 21.84,64.52 17.4,64.52 16.96,64.07 R14.2 R13.2 R12.2 17.02,57.47 17.02,56.26 v19.3,53.98 19.53,53.98 19.94,53.57 L2.2 | 58.42,69.33 U4.29 58.52,69.26 | v30.61,49.78 31.24,49.15 U5.56 31.24,46.48 31.62,46.1 34.04,46.1 34.24,46.3 U5.50 | 31.72,57.78 LED4.A | LED1.A 32.39,10.66 33.91,9.14 37.85,9.14 | 37.85,9.14 39.75,9.14 40.7,10.09 U2.15 40.7,17.34 39.69,18.35 R3.1 | C4.1 37.91,9.21 37.85,9.14 | U5.42 38.34,42.66 39.24,43.56 | 39.24,43.56 39.5,43.81 C23.1 41.26,43.81 | U3.12 70.13,44.8 68.96,45.97 68.96,51.82 67.69,53.09 R16.2 | 52.96,31.43 R6.2 | U5.31 34.24,35.1 35.81,33.66 v36.96,33.66 | C28.2 51.18,69.72 51.05,69.6 | v38.73,44.07 39.24,43.56 | C21.1 29.72,53.21 29.84,53.09 | U5.20 28.74,37.43 28.45,37.72 26.42,37.72 25.4,36.7 25.4,34.86 R10.1 | 71.8,8.34 JP1.1 | JP7.1 44.12,56.52 | 44.2,57.66 44.17,57.68 | 75.31,61.98 C30.2
  Top 0.406: LED4.A LED3.A | 21.84,34.8 v21.72,34.8 L1.2 20.28,32.74 C22.1 24,32.51 25.2,33.71 25.2,35.04 R10.1 25.4,34.99 25.4,34.86 | 31.72,57.78 30.35,57.78 29.84,57.28 29.84,53.09 29.84,50.55 v30.61,49.78 | C39.2 74.71,44.8 | 76.2,36.58 75.46,37.32 73.93,37.32 JP6.1 | C39.2 | 52.96,31.43 52.96,34.42 50.55,36.85 41.88,36.85 41.27,36.85 40.79,36.37 40.79,35.06 C20.1 40.27,34.54 39.88,34.54 38.99,33.66 v36.96,33.66 | 44.2,57.53 JP7.1 | 44.2,57.53 44.2,57.66 44.2,58.17 46.97,60.94 BKGND.1 | R3.1 29.15,18.35 27.91,17.12 24.77,17.12 23.98,17.91 23.98,27.58 23.55,28.02 23.27,28.02 | C30.2 75.03,61.98 | 22.5,28.02 22.61,28.12 | U3.12 C39.2 | v41.55,59.51 41.55,58.24 42.11,57.68 44.04,57.68 44.2,57.53
  Top 0.61: U4.29 58.51,67.6 58.51,67.17 60.21,65.46 | 60.21,65.46 62.41,63.25 U4.17 68.05,63.25 | C28.2 51.18,68.07 52.01,67.25 U4.34 55.16,67.25 57.3,65.1 59.84,65.1 60.21,65.46 | 74,8.34 76.2,10.54 76.2,36.58 76.2,44.32 | 76.2,44.32 75.69,44.83 C39.2 | 51.05,69.6 46.99,69.6 | 76.2,44.32 76.71,44.83 77.29,44.86 78.61,46.18 78.61,60.83 77.47,61.98 75.31,61.98 | 68.05,63.25 70.38,63.25 70.71,62.92 C31.2 75.03,61.98 | 46.99,69.6 v43.33,69.6 | 46.99,69.6 JP8.1 | 68.05,63.25 v68.05,63.93
  Top 0.813: 71.8,8.34 74,8.34 73.99,8.33 73.99,4.7 73.28,3.99 25.5,3.99 22.63,6.83 v22.63,8.66 | C22.1 19.94,32.4 19.94,31.24 19.43,30.73 19.43,28.02 | 23.27,28.02 22.5,28.02 19.43,28.02 | 22.61,28.12 JP4.1 | v17.7,25.4 16.13,25.4 | 16.13,25.4 VREG1.2 C14.+ | 19.43,28.02 17.45,28.02 16.15,26.72 16.15,25.43 16.13,25.4
  Bottom 0.203: 22.86,41.94 22.86,41.91
  Bottom 0.254: v43.33,69.6 43.31,69.6
  Bottom 0.305: 36.58,44.32 38.48,44.32 v38.73,44.07
  Bottom 0.406: 43.31,69.6 41.53,67.82 41.53,59.54 v41.55,59.51 | 22.1,48.13 27.05,48.13 28.32,49.4 30.23,49.4 v30.61,49.78 | 22.1,48.13 20.83,48.13 18.67,50.29 18.67,53.34 v19.3,53.98 | v36.96,33.66 36.96,38.86 33.88,41.94 | v21.72,34.8 21.87,34.8 22.1,35.03 22.1,41.94 | 22.1,41.94 22.86,41.94 33.88,41.94 | 22.1,41.94 22.1,48.13 | JP5.1 72.64,75.01 68.05,70.41 v68.05,63.93 | 33.88,41.94 36.27,44.32 36.58,44.32
  Bottom 0.813: v17.7,25.4 21.01,25.4 22.63,23.78 22.63,11.86 v22.63,8.66
+12V  (via drill 0.6 pad 0.81)
  Top 0.305: R27.2 7.32,24.84 SJ9.3
  Top 0.813: 3.28,24.84 2.48,24.84 1.52,23.88 1.52,12.09 1.5,11.2 2.67,10.03 3.81,10.03 | 3.28,24.84 SJ9.3 | v70.23,23.11 66.61,23.11 R8.2 | JP2.1 3.81,10.03 | 3.28,24.84 C34.+ | 3.81,10.03 7.26,10.03 9.4,12.17 VREG2.3 12.24,10.19 12.93,9.5 12.93,7.64 C32.1 v15.24,7.62
  Bottom 0.813: v70.23,23.11 74.68,23.11 77.98,19.81 77.98,6.6 76.58,5.21 17.65,5.21 v15.24,7.62
-12V  (via drill 0.6, 0.6 pad 0.81)
  Top 0.813: R9.2 68.49,32.7 69.57,31.62 v73.71,31.62 | JP2.3 3.81,17.27 3.81,18.95 LED5.C | C35.- v7.92,7.75
  Bottom 0.813: v73.71,31.62 79.25,26.11 79.25,6.22 77.09,4.06 9.78,4.06 6.73,7.11 6.73,7.64 | 6.73,7.64 6.73,14.4 6.07,15.06 3.83,15.06 JP2.3 | v7.92,7.75 6.73,7.75 6.73,7.64
\RESET
  Top 0.254: U5.14 24.05,39.16 23.37,38.48 23.37,35.37 R10.2
ADC0
  Top 0.254: U4.23 63.31,70.17 66.42,73.28 69.22,73.28 70.23,74.3 70.23,75.82 JP5.2
ADC1
  Top 0.254: U4.24 62.51,70.64 66.04,74.17 67.56,74.17 67.69,74.3 67.69,75.82 JP5.3
ADC2
  Top 0.254: U4.25 61.71,70.98 65.02,74.3 JP5.4
ADC3
  Top 0.254: U4.26 60.91,71.32 62.48,72.9 JP5.5
ADC4
  Top 0.254: U4.27 60.11,71.87 59.94,72.03 JP5.6
ADC5
  Top 0.254: U4.28 59.31,71.14 57.4,73.05 57.4,73.08 57.4,75.31 JP5.7
ADC6
  Top 0.254: U4.31 56.91,70.98 54.86,73.03 JP5.8
ADC7
  Top 0.254: U4.32 56.11,70.76 52.32,74.55 JP5.9
DM
  Top 0.254: X2.D- 9.99,42.38 10.29,42.67 25.35,42.67 U5.7
DP
  Top 0.254: U5.8 10.66,42.16 9.65,41.15 6.73,41.15 6.73,42.36 X2.D+
ECS  (via drill 0.6)
  Top 0.254: R3.2 39.94,20.25 40.44,20.75 | 53.92,18.62 53.72,18.41 53.34,18.03 47.75,18.03 47.37,18.41 42.93,18.41 42.77,18.41 40.44,20.75 | 53.92,18.62 54.21,18.9 U1.24 | U2.6 40.7,21.01 40.44,20.75 | v54.74,17.02 54.74,17.8 53.92,18.62
  Bottom 0.254: v54.74,17.02 54.74,11.81 54.1,11.18 54.1,8.53 53.98,8.4 JP1.8
FTGPIO0
  Top 0.254: U5.26 31.75,34.8 31.75,33.91 30.86,33.02 28.96,33.02 28.45,32.51 26.91,32.51 26.91,32.5 JP4.2
FTGPIO1
  Top 0.254: U5.27 32.24,34.27 32.24,33.63 31.11,32.51 29.45,32.51 29.45,32.5 JP4.3
FTGPIO2
  Top 0.254: U5.28 32.74,33.26 32.74,33.25 JP4.4
FTGPIO3
  Top 0.254: U5.29 33.24,31.22 33.24,31.21 JP4.5
FTGPIO4
  Top 0.254: U5.30 33.74,34.72 35.31,33.15 35.31,31.26 JP4.6
FTGPIO5  (via drill 0.6 pad 0.81)
  Top 0.254: U5.32 34.74,35.49 35.43,34.8 v35.81,34.8
  Bottom 0.254: v35.81,34.8 35.81,32.89 36.45,32.26 37.59,32.26 37.85,32 37.85,31 JP4.7
FTGPIO6  (via drill 0.6 pad 0.81)
  Top 0.254: U5.33 37.53,38.16 38.73,36.96 39.37,36.96 v39.75,37.34
  Bottom 0.254: v39.75,37.34 40.13,37.34 40.39,37.34 40.39,36.2 40.39,31.13 JP4.8
FTGPIO7  (via drill 0.6 pad 0.81)
  Top 0.254: U5.34 38.28,38.66 38.46,38.48 39.5,38.48 v41.91,38.48
  Bottom 0.254: v41.91,38.48 42.29,38.48 42.93,37.85 42.93,36.07 42.93,35.18 42.93,31 JP4.9
GND  (via drill 0.6, 0.6 pad 0.81, 3.2)
  Top 0.254: U4.30 57.78,69.17 | U2.11 36.71,16.39 36.7,16.38 | U2.14 40.05,13.88 38.99,12.83 36.2,12.83 35.94,13.08 35.94,14.29 C1.2 | U2.19 43.3,17.64 43.56,17.91 45.34,17.91 v45.72,17.53 | U1.12 60.58,26.37 59.05,27.89 58.14,27.89 v57.25,28.78 | 23.75,40.64 23.77,40.66 U5.11 U5.10 | 42.67,62.99 42.55,62.87 | 68.33,61.72 68.33,60.07 69.83,60.07 | 61.86,45.45 U3.4 | C24.2 21.59,49.02 | 19.81,44.32 20.48,43.66 U5.5 25.39,43.66 26.54,43.66 26.8,43.94 26.8,45.47 26.6,45.66 U5.1 | 23.24,39.62 23.28,39.66 U5.13 25.37,39.65 26.92,39.65 26.9,39.62 26.8,39.62 26.92,39.5 26.92,38.86 26.72,38.66 U5.15 | U1.5 64.3,21.5 v64.54,21.74 | U5.47 42.6,45.16 43.05,44.7 43.05,43.83 C23.2 | U5.25 31.24,37.46 31.5,37.72 34.8,37.72 35.81,36.7 v35.81,36.2 | U4.35 47.4,66.45 BKGND.5 | U4.16 63.21,62.45 62.53,61.77 | U5.35 35.19,39.16 v34.82,39.52 | U5.51 33.74,48.85 34.11,49.23 34.98,49.23
  Top 0.305: U4.39 51.74,63.25 50.98,64.01
  Top 0.406: C19.2 24,51.31 v25.91,53.21 | U4.30 57.71,67.44 v57.2,66.93
  Top 0.813: 13.72,27.7 VREG1.1 13.59,27.7
  Bottom 0.254: v64.54,21.74 64.77,21.97
  other vias: 20.7,36.45 20.32,55.63 32.92,16.99 4.62,68.4 4.62,61.37 13.21,58.67 13.08,50.67 41.68,53.29 44.15,48.16 20.37,2.24 76.86,1.8 70.23,27.56 72.64,13.72 54.48,35.74 14.1,69.09 18.41,72.52 25.02,72.64 41.48,72.57 36.07,62.56 43.46,73.2 75.06,73.25 81.66,64.52 73.41,58.67 76.07,52.32 61.85,17.14 63.63,45.47 74.68,40.26 18.16,44.45 46.46,38.79 13.08,40.31 74.04,33.66 32.56,20.22 53.09,13.59 42.67,9.91 50.67,28.45 38.73,32.77 38.23,34.8 36.07,55.75 17.68,20.73 28.98,22.38 12.22,14.48 8.79,16.79 5.82,32.94 46.35,34.42 23.24,40.39 62.87,13.72 45.92,28.8 75.36,63.42 77.47,30.48 58.6,50.62 68.45,25.27 4,76 81,76 4,4 81,4 34.11,12.83 39.6,12.93 30.58,16.99 82.17,50.22 82.27,30.35 82.17,11.58 36.55,2.03 54.2,1.85 67.21,1.85 4.55,53.87 11.89,78.31 26.85,78.33 65.84,69.95 64.34,39.55 36.47,70.33 48.69,72.8 53.59,70.69 9.09,30.33 25.07,23.44 25.35,6.76 44.81,43.87 73.99,35.03 74.19,11.66 18.92,8.66 30.96,43.71 77.77,41.3 70.69,57.78 50.29,62.84 62.48,61.77
  pour Top (isolate 0.254): 0,80 0,0 85,0 85,80
  pour Bottom (isolate 0.254): 85,80 85,0 0,0 0,80
INN1
  Top 0.254: U1.10 61.48,24.75 61.77,25.04 61.77,27.74 JP9.4
INN2
  Top 0.254: U1.8 62.44,23.45 62.94,23.95 62.94,26.26 63.73,27.05 66.14,27.05 66.32,27.23 JP9.2
INP1
  Top 0.254: U1.9 61.95,24.1 62.33,24.49 62.33,27.69 62.92,28.27 JP9.3
INP2
  Top 0.254: U1.7 62.55,22.8 63.4,23.65 63.4,26.06 63.96,26.62 68.3,26.62 68.86,27.18 JP9.1
N$1
  Top 0.254: C1.1 39.12,14.35 39.4,14.63 U2.13
N$2
  Top 0.254: U2.18 42.65,15.39 43.69,14.35 44.13,14.35 C2.2
N$3
  Top 0.254: U2.17 42,15.15 43.05,14.1 43.05,12.7 43.18,12.57 44.13,12.57 C2.1
N$4
  Top 0.254: U4.2 56.13,57.22 56.13,54.36 57.44,53.05 SJ11.2 57.42,48.01
N$6  (via drill 0.6)
  Top 0.254: v62.74,19.05 62.23,19.56 U1.2 | R1.1 52.07,19.36 52.07,20.57 52.07,20.75 52.48,21.16 v53.34,21.16
  Bottom 0.254: v62.74,19.05 62.23,19.56 58.04,19.56 57.48,19.56 55.88,21.16 v53.34,21.16
N$7  (via drill 0.6)
  Top 0.254: v60.45,17.65 60.45,18.78 U1.1 | R2.1 53.21,16.76 v53.47,17.02
  Bottom 0.254: v60.45,17.65 60.07,18.03 54.1,18.03 53.47,17.4 v53.47,17.02
N$8
  Top 0.254: R4.1 41.35,27.87 R4.1 | U2.5 41.35,24.54 40.92,24.97 40.92,27.44 R4.1
N$10
  Top 0.254: 53.02,29.34 R6.1 53.09,26.67 53.7,26.05 U1.13
  Top 0.305: 53.02,29.34 51.84,29.34 51,30.18 51,31.42 50.52,31.9 48.78,31.9 C7.1
N$11
  Top 0.254: U1.6 62.92,22.15 63.63,22.86 64.45,22.86 R8.1 C9.2
N$12
  Top 0.254: U1.4 68.93,20.85 C8.1 68.96,20.89 R7.1
N$13  (via drill 0.6)
  Top 0.254: D1.3 58.74,32.77 59.94,31.57 60.71,30.81 C10.2 | U1.11 59.48,25.4 v59.28,25.6 | v65.02,30 65.02,30.77 65.05,30.8
  Top 0.305: C10.2 65.05,30.8 R9.1
  Bottom 0.254: v59.28,25.6 59.49,25.4 63.68,25.4 65.02,26.75 v65.02,30
N$14
  Top 0.254: U4.36 53.17,65.66 45.72,65.66 45.67,65.66 BKGND.6
N$15  (via drill 0.6)
  Top 0.254: 48.56,50.64 47.91,50.64 45.37,50.64 v44.07,51.94 | 48.56,50.64 C12.1 | v25.15,47.12 23.62,47.12 22.86,46.35 22.86,45.24 23.44,44.65 25.32,44.65 U5.3 | 48.56,50.64 48.51,50.59 48.62,50.49 Y1.2
  Bottom 0.254: v44.07,51.94 39.88,51.94 35.43,47.5 34.04,46.1 27.18,46.1 26.16,47.12 v25.15,47.12
N$16  (via drill 0.6 pad 0.81)
  Top 0.254: R12.1 22.16,57.53 U6.1 22.1,57.47 v22.1,55.63 | U5.63 27.74,48.59 27.05,49.28 25.53,49.28 v25.27,49.28
  Bottom 0.254: v25.27,49.28 23.37,49.28 22.1,50.55 22.1,52.7 21.72,53.09 21.72,55.24 v22.1,55.63
N$17  (via drill 0.6 pad 0.81)
  Top 0.254: R13.1 22.48,59.94 23.5,58.93 23.5,57.59 U6.2 | U5.62 28.24,48.85 27.05,50.04 26.8,50.29 v26.29,50.29 | v22.86,53.34 22.99,53.47 22.99,55.5 23.5,56.01 23.5,57.51
  Top 0.305: 23.5,57.51 U6.2
  Bottom 0.254: v26.29,50.29 25.4,50.29 23.24,52.45 22.86,52.83 v22.86,53.34
N$18  (via drill 0.6 pad 0.81)
  Top 0.254: U6.3 24.7,57.53 R15.1 24.69,55.1 24.69,54.23 24.13,53.67 v24.13,53.47 | v27.56,51.18 27.56,50.42 28.74,49.24 U5.61
  Bottom 0.254: v27.56,51.18 25.27,51.18 24.13,52.32 v24.13,53.47
N$19  (via drill 0.6)
  Top 0.254: U5.2 | v23.75,45.72 24.31,45.16 U5.2 | v38,46.74 45.85,46.74 48.62,43.97 Y1.1 48.62,41.68 49.3,41 53.39,41 C13.1
  Bottom 0.254: v23.75,45.72 24.26,45.21 24.51,45.21 26.42,45.21 33.91,45.21 33.96,45.21 35.48,46.74 v38,46.74
N$20
  Top 0.254: U5.54 32.23,49.12 32.77,49.66 34.09,49.66 34.31,49.89 R17.1
  Top 0.305: R17.1 34.29,50.91
N$21
  Top 0.254: U5.55 31.74,51.67 R18.1
N$22
  Top 0.254: U5.6 25.34,43.18 15.88,43.18 14.29,43.18 14.29,43.81 R11.2
N$23
  Top 0.254: R17.2 34.31,55.55
  Top 0.305: 34.31,55.55 LED3.C
N$24
  Top 0.254: R15.2 26.6,56.94 U6.4 25.91,57.64 25.91,59.69 25.02,60.58 20.37,60.58 20.04,60.91 20.04,61.98 19.66,62.36 R14.1
N$25
  Top 0.254: 31.81,55.56 R18.2
  Top 0.305: LED4.C 31.81,55.56
N$30
  Top 0.254: C24.1 21.52,45.94 | 19.84,45.99 18.28,45.99 C26.+ | 19.84,45.99 C24.1 | 19.84,45.99 19.84,49.02 19.84,50.61 L2.1 | U5.4 22.21,44.16 21.59,44.78 C24.1
N$31
  Top 0.254: U5.9 23.25,41.66 21.21,41.66 20.7,41.15 C25.1 20.59,39.75 19.68,39.75 19.56,39.62 18.92,38.99 18.41,38.48 17.53,38.48 17.53,38.23 C27.+ 17.53,35.43 18.16,34.8 L1.1
N$32
  Top 0.254: 49.66,22.1 49.6,22.1 SJ8.2 50.09,21.97 50.27,22.15 U1.19
N$34
  Top 0.813: SJ9.2 8.84,26.36 9.5,25.7 9.5,23.85 10.26,23.09 13.85,23.09 VREG1.3 13.83,23.07 C15.1
N$35
  Top 0.254: SJ10.1 73.34,65.15 R24.2 R23.1
N$36
  Top 0.305: R25.1 30.62,11.93 31.06,12.37 31.06,13.69 31.37,13.99 LED1.C
N$37
  Top 0.305: LED2.C 11.68,31.8 R26.2
N$38
  Top 0.254: U5.59 29.74,49 28.57,50.16 28.57,53.34 28.57,60.83 29.08,61.34 R22.2 29.84,61.41 R21.2
N$39
  Top 0.305: LED5.A 3.87,21.08 5.08,21.08 5.59,20.57 5.59,19.71 6.2,19.1 7.31,19.1 R27.1
N$54  (via drill 0.6 pad 0.81)
  Top 0.254: v65.41,40.77 65.41,42.82 U3.8 62.23,42.94 R29.2
  Top 0.305: U3.16 70.91,49.07 v71.25,49.4
  Top 0.406: R29.2 61.78,42.85 | U3.16 72.25,47.39 72.95,48.08 72.95,52.07 R28.1
  Bottom 0.254: v71.25,49.4 68.58,49.4 67.82,48.64 67.82,41.15 67.06,40.39 65.79,40.39 v65.41,40.77
SCL  (via drill 0.6)
  Top 0.254: v62.99,38.1 62.99,36.7 65.28,34.42 70.99,34.42 71.5,34.92 71.5,37.21 JP6.2 | U4.40 55.99,62.45 v56.01,62.43
  Bottom 0.254: v62.99,38.1 61.21,39.88 61.21,44.7 63.63,47.12 63.63,57.28 58.47,62.43 v56.01,62.43
SDA  (via drill 0.6)
  Top 0.254: U4.41 55.3,61.65 v55.98,60.96
  Bottom 0.254: JP6.3 68.83,35.31 67.94,34.42 63.88,34.42 60.71,37.59 60.71,44.96 62.61,46.86 62.61,57.4 59.05,60.96 v55.98,60.96
SPI_UC_CS
  Top 0.254: U3.15 70.09,46.75 69.72,47.12 69.72,56.13 69.22,56.64 68.96,56.9 67.06,58.8 66.55,59.31 65.37,59.31 U4.12
SPI_UC_MISO  (via drill 0.6 pad 0.81)
  Top 0.254: v66.55,51.18 67.31,50.42 67.31,43.81 67.07,43.58 U3.7 | v67.18,60.07 65.33,60.07 U4.13
  Bottom 0.254: v66.55,51.18 66.55,57.78 67.44,58.67 67.44,59.82 v67.18,60.07
SPI_UC_MOSI  (via drill 0.6 pad 0.81)
  Top 0.254: v65.79,49.66 66.42,49.66 66.67,49.4 66.67,46.35 66.42,46.1 65.37,46.1 U3.3 | v65.41,57.15 65.28,57.15 63.75,58.67 63.42,59 63.42,60.5 63.77,60.85 U4.14
  Bottom 0.254: v65.41,57.15 65.41,50.04 v65.79,49.66
SPI_UC_SCK  (via drill 0.6 pad 0.81)
  Top 0.254: v67.06,61.47 66.93,61.59 65.36,61.59 U4.15 | U3.11 69.33,44.21 68.07,45.47
  Top 0.305: 68.07,45.47 v68.07,51.31
  Bottom 0.254: v68.07,51.31 68.07,60.45 v67.06,61.47
SPICLK  (via drill 0.6)
  Top 0.254: v56.01,17.02 56.01,23.88 55.78,24.1 U1.16 52.73,24.1 52.07,24.77 v50.47,24.77 | U5.16 25.36,37.68 25.36,37.5 25.04,37.19 v24.38,37.19 | U2.7 40.05,23.87 v40.41,24.23 | U3.10 69.61,43.58 69.09,43.05 69.09,41.15 69.6,40.64 v70.1,40.64
  Bottom 0.254: v56.01,17.02 56.01,11.81 56.39,11.43 56.39,8.52 56.39,8.51 JP1.7 | v70.1,40.64 70.1,30.1 70.1,30.02 69.55,29.46 68.17,29.46 67.67,28.96 67.67,26.31 66.12,24.77 62.87,24.77 62.61,24.77 62.36,24.77 62.1,24.77 v50.47,24.77 49.94,24.23 49.81,24.23 42.55,24.23 42.19,23.88 40.74,23.88 40.74,23.9 v40.41,24.23 40.18,24 39.12,24 39.01,24 36.25,24 35.56,24 32.64,24 30.48,26.21 25.35,26.21 23.75,27.81 23.75,36.07 23.75,36.93 24,37.19 v24.38,37.19
SPIIN  (via drill 0.6)
  Top 0.254: v57.28,17.02 57.28,23.75 56.27,24.75 U1.15 53.22,24.75 52.32,25.65 v51.56,25.65 | U3.2 61.48,46.75 58.42,43.69 57.91,43.18 v57.91,34.92 | 27.24,35.24 U5.17 | 27.24,35.24 v26.8,34.8 27.24,35.24 | v26.42,28.32 38.35,28.32 38.61,28.07 v38.61,25.53 38.61,24.51 38.86,24.26 39.4,23.72 U2.8
  Bottom 0.254: v57.28,17.02 57.28,12.45 58.67,11.18 59.05,10.79 59.05,9.03 JP1.6 | v57.91,34.92 60.2,34.92 60.83,34.29 60.83,32.74 60.15,32.05 60.15,27.94 60.02,27.81 57.86,25.65 57.53,25.65 v51.56,25.65 51.51,25.6 44.17,25.6 43.74,25.6 43.43,25.91 39.14,25.91 38.99,25.91 v38.61,25.53 | v26.8,34.8 26.8,32.89 26.54,32.64 26.42,32.51 v26.42,28.32
SPIOUT  (via drill 0.6)
  Top 0.254: v58.55,17.02 58.55,23.88 57.02,25.4 U1.14 53.59,25.4 51.94,27.05 v50.55,27.05 | U2.9 38.73,22.23 38.73,23.5 37.97,24.26 37.39,24.84 37.39,25.6 v37.39,27.36 37.39,27.18 v28.83,27.18 | v59.56,33.66 59.56,42.8 60.92,44.15 60.98,44.21 U3.6 | U5.18 27.74,33.86 v27.81,33.78
  Bottom 0.254: v58.55,17.02 58.55,13.34 61.47,10.41 61.47,8.52 61.47,8.51 JP1.5 | v37.39,27.36 37.69,27.05 38.63,27.05 44.22,27.05 44.73,27.56 46.51,27.56 47.02,27.05 v50.55,27.05 53.72,27.05 53.85,27.05 57.15,27.05 57.53,27.05 57.78,27.05 59.56,28.96 v59.56,33.66 | v27.81,33.78 28.45,33.78 28.83,33.4 v28.83,27.18
START  (via drill 0.6)
  Top 0.254: U2.4 42,21.12 42.93,20.19 44.83,20.19 | 44.83,20.19 47.5,20.19 47.88,20.57 48.64,20.57 48.64,21.79 SJ8.1 48.57,23.24 47.5,24.26 47.5,25.4 47.24,25.65 47.12,25.78 46.99,25.91 45.87,25.91 45.77,25.91 v45.06,26.62 | v39.24,35.94 38.86,35.94 37.47,37.47 35.81,37.47 33.33,39.95 30.05,39.95 29.21,39.12 29.21,38.48 29.21,36.31 U5.21 | 44.83,20.19 44.83,19.94 v45.09,19.68 45.21,19.68 | v50.16,10.92 62.87,10.92 64.15,10.92 65.28,10.92 66.67,9.53 JP1.3 | SJ5.2 71.12,67.56 71.37,67.56 72.01,68.2 72.01,69.47 72.77,70.23 78.61,70.23 79.5,69.34 79.5,64.26 79.5,64.14 79.5,8.76 v76.73,8.76
  Bottom 0.254: v39.24,35.94 39.75,35.05 39.75,32.51 39.12,31.88 39.14,29.31 38.84,29.01 37.85,29.01 36.88,29.01 36.3,28.42 36.3,26.85 36.73,26.42 36.75,26.42 37.97,26.42 | v45.09,19.68 45.59,19.68 45.97,19.3 46.1,19.18 47.5,19.18 48.26,18.41 49.53,17.14 49.53,11.56 v50.16,10.92 | 38.53,26.42 37.97,26.42 | 38.53,26.42 37.97,26.42 | 38.53,26.42 44.86,26.42 v45.06,26.62 | v76.73,8.76 74.42,6.45 67.31,6.45 66.73,7.03 66.73,8.32 JP1.3
SYNC
  Top 0.254: R5.2 48.7,26.54 | U1.18 50.22,22.8 48.77,24.26 R5.2 | R4.2 44.81,27.89 45.01,27.89 45.85,27.05 46.35,26.54 48.71,26.54 R5.2
UC_GPIO0
  Top 0.254: SJ5.1 68.83,67.56 67.72,66.45 U4.21 | U4.21
UC_GPIO1
  Top 0.254: U4.22 65.32,67.23 67.36,67.23 67.72,67.59 67.72,69.06 68.63,69.98 SJ6.1
UC_GPIO2
  Top 0.254: SJ7.1 54.81,53.16 55.32,53.67 55.32,57.23 U4.1
UC_GPIO3
  Top 0.254: SJ10.2 68.2,65.15 67.18,64.14 65.4,64.14 U4.18
UC_GPIO4  (via drill 0.6)
  Top 0.254: U4.19 62.53,64.85 v61.98,65.41
  Bottom 0.254: v61.98,65.41 61.87,65.41 60.27,67 60.27,69.85 58.24,71.86 46.43,71.86 46.35,71.86 46,71.86 JP8.3
UC_GPIO5  (via drill 0.6)
  Top 0.254: U4.20 63.18,65.65 v61.77,67.06
  Bottom 0.254: v61.77,67.06 61.77,70.26 58.32,73.71 47.98,73.71 46.69,73.71 JP8.2
UC_GPIO6  (via drill 0.6)
  Top 0.254: U4.33 53.75,69.25 v53.65,69.14
  Bottom 0.254: v53.65,69.14 50.14,69.14 48.49,70.79 45.82,70.79 44.53,70.79 JP8.4
UC_GPIO7  (via drill 0.6)
  Top 0.305: U4.4 v57.71,63.6
  Bottom 0.254: JP8.5 42.42,70.36 47.65,70.36 52.05,65.96 54.41,63.6 v57.71,63.6
UC_RXD2
  Top 0.254: U4.44 49.85,59.25 49.28,58.67 49.28,56.63 JP7.3
UC_TXD2
  Top 0.254: U4.43 48.11,60.05 46.61,58.55 46.61,56.56 46.66,56.52 JP7.2
UCRXD  (via drill 0.6)
  Top 0.254: U4.9 61.71,54.85 v61.59,54.74 | v39.24,41.15 38.73,40.64 36.63,40.64 U5.38
  Bottom 0.254: v61.59,54.74 61.59,46.86 55.37,40.64 40.01,40.64 39.5,41.15 v39.24,41.15
UCTXD  (via drill 0.6)
  Top 0.254: U4.8 60.91,55.58 v60.2,54.86 | v39.75,42.42 39.12,42.42 37.85,41.15 36.62,41.15 U5.39
  Bottom 0.254: v60.2,54.86 60.2,46.35 54.99,41.15 41.02,41.15 v39.75,42.42
VNEG  (via drill 0.6)
  Top 0.254: U2.2 43.3,24.08 C3.2 43.63,25.21 43.81,25.4 46.61,25.4 46.99,25.02 46.99,22.35 46.35,21.72 44.96,21.72 v44.96,21.97 | R2.2 48.01,16.76 v47.62,17.14
  Bottom 0.254: v47.62,17.14 47.62,18.16 47.12,18.67 44.32,18.67 43.69,19.3 | 43.41,19.02 43.69,19.3 | 43.41,19.02 43.34,18.95 | 43.69,19.3 43.69,20.45 44.96,21.72 v44.96,21.97 | JP3.3 43.31,18.92 43.41,19.02
VPOS  (via drill 0.6)
  Top 0.254: U2.1 43.95,22.74 44.32,23.11 44.83,23.11 45.09,23.37 45.09,24.19 C3.1 45.72,24.26 46.1,24.13 v46.1,22.73 | R1.2 49.4,19.3 49.02,19.68 48.9,19.68 v48.39,19.68
  Bottom 0.254: v48.39,19.68 46.61,19.68 46.1,20.32 v46.1,22.73 45.97,22.86 37.47,22.86 36.83,22.23 32.26,22.23 30.45,24.03 27.39,24.03 JP3.1
VREF  (via drill 0.6)
  Top 0.254: C6.1 64.77,19.94 64.5,20.2 U1.3 66.28,20.2 66.93,19.56 v66.93,18.03 | v41.66,13.21 41.66,14.1 41.35,14.41 U2.16
  Bottom 0.254: v66.93,18.03 66.93,12.83 65.66,11.56 65.41,11.3 65.41,6.48 65.02,6.1 48.13,6.1 42.93,11.3 41.66,12.57 v41.66,13.21 41.66,13.97 26.16,13.95 26.01,13.95 23.57,16.38 23.57,20.17 24.87,21.46 JP3.2
VUSB  (via drill 0.6, 0.6 pad 0.81)
  Top 0.254: R28.2 72.94,56.04 v73.53,56.64 | v77.29,68.07 R23.2
  Top 0.305: 8.73,33.87 8.73,33.86 | LED2.A 9.96,37.05 8.73,35.81
  Top 0.813: SJ9.1 7.37,27.91 7.37,32.51 8.73,33.87 8.73,35.81 X2.VBUS | v31.77,64.54 R22.1 | C36.+ 9.88,51.1 v9.88,51.08
  Bottom 0.254: v73.53,56.64 76.58,56.64 77.29,57.35 v77.29,68.07
  Bottom 0.813: X2.VBUS 10.16,39.88 10.92,40.64 10.92,51.08 | v77.29,68.07 77.29,76.81 75.89,78.23 32.72,78.23 30.66,76.17 29.64,76.17 | 29.64,76.17 15.27,76.17 15.24,76.2 10.92,71.88 10.92,51.08 | 29.64,76.17 29.72,76.1 29.72,73.79 31.77,71.73 v31.77,64.54 | 10.92,51.08 v9.88,51.08

### Text on the board
tNames: Captura EcoG | BRUNOSMMM
bNames: 09042011 | Captura EcoG